# EAGLE schematic ESP-XBee_v0.1 (EAGLE 7.5.0)
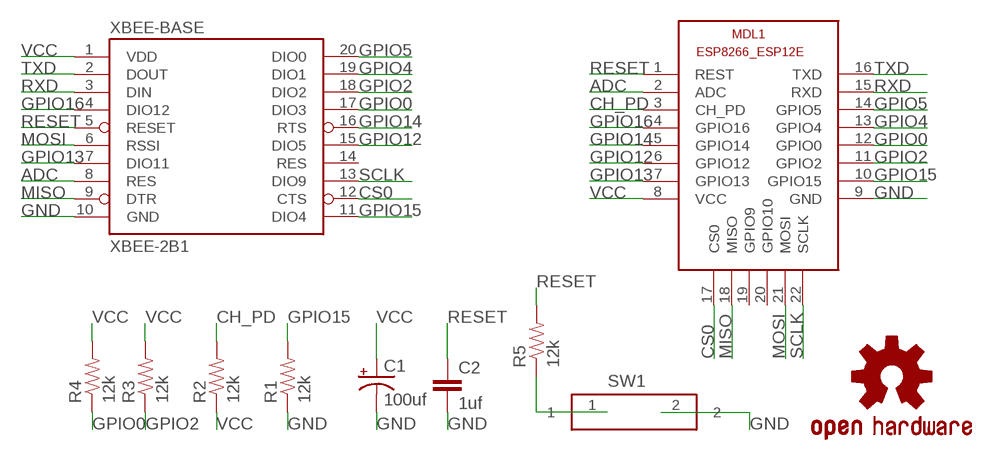
[diagram p0: schematic, sheet 1]

## Parts
C1  100uf  CAP_POL1206-KIT  [EIA3216-KIT]
C2  1uf  CAP0805  [0805]
LOGO3  OSHW-LOGOS  [OSHW-LOGO-S]
MDL1  ESP8266-12EESP8266-ESP12E  [ESP8266-ESP12E]
R1  12k  RESISTOR0805-RES  [0805]
R2  12k  RESISTOR0805-RES  [0805]
R3  12k  RESISTOR0805-RES  [0805]
R4  12k  RESISTOR0805-RES  [0805]
R5  12k  RESISTOR0805-RES  [0805]
SW1  434111043826  [434111043826]
XBEE-BASE  XBEE-2B1  [XBEE-1]

## Nets
ADC: MDL1.2(ADC) XBEE-BASE.8(RES)
CH_PD: MDL1.3(CH_PD) R2.2
CS0: MDL1.17(CS0) XBEE-BASE.12(CTS)
GND: C1.C(-) C2.2 MDL1.9(GND) R1.1 SW1.2 XBEE-BASE.10(GND)
GPIO0: MDL1.12(GPIO0) R4.1 XBEE-BASE.17(DIO3)
GPIO2: MDL1.11(GPIO2) R3.1 XBEE-BASE.18(DIO2)
GPIO4: MDL1.13(GPIO4) XBEE-BASE.19(DIO1)
GPIO5: MDL1.14(GPIO5) XBEE-BASE.20(DIO0)
GPIO12: MDL1.6(GPIO12) XBEE-BASE.15(DIO5)
GPIO13: MDL1.7(GPIO13) XBEE-BASE.7(DIO11)
GPIO14: MDL1.5(GPIO14) XBEE-BASE.16(RTS)
GPIO15: MDL1.10(GPIO15) R1.2 XBEE-BASE.11(DIO4)
GPIO16: MDL1.4(GPIO16) XBEE-BASE.4(DIO12)
MISO: MDL1.18(MISO) XBEE-BASE.9(DTR)
MOSI: MDL1.21(MOSI) XBEE-BASE.6(RSSI)
N$1: R5.1 SW1.1
RESET: C2.1 MDL1.1(REST) R5.2 XBEE-BASE.5(RESET)
RXD: MDL1.15(RXD) XBEE-BASE.3(DIN)
SCLK: MDL1.22(SCLK) XBEE-BASE.13(DIO9)
TXD: MDL1.16(TXD) XBEE-BASE.2(DOUT)
VCC: C1.A(+) MDL1.8(VCC) R2.1 R3.2 R4.2 XBEE-BASE.1(VDD)
Unconnected: MDL1.19(GPIO9) MDL1.20(GPIO10) XBEE-BASE.14(RES)

## Library data of the parts
C1 = SparkFun-Capacitors:CAP_POL: Capacitor Polarized These are standard SMD and PTH capacitors. Normally 10uF, 47uF, and 100uF in electrolytic and tantalum varieties. Always verify the external diameter of the through hole cap, it varies with capacity, voltage, and manufacturer. The EIA devices should be standard.
C2 = SparkFun-Capacitors:CAP: Capacitor Standard 0603 ceramic capacitor, and 0.1" leaded capacitor.
LOGO3 = SparkFun-Aesthetics:OSHW-LOGO: Open Source Hardware Logo This logo indicates the piece of hardware it is found on incorporates a OSHW license and/or adheres to the definition of open source hardware found here: http://freedomdefined.org/OSHW
MDL1 = ESP8266-ESP12E:ESP8266-12E: ESP8266-12E with additional I/O and GPIO04/05 corrected The author cannot warrant that this library is free from error or will meet your specific requirements. Created by PuceBaboon.com. Komagane, Nagano, JAPAN
R1-R5 = SparkFun-Passives:RESISTOR: Resistor Basic schematic elements and footprints for 0603, 1206, and PTH resistors.
SW1 = Switches_rev16a:434111043826: WS-TRS-6x3.5 mm SMD Tact Switch, 2 pins
XBEE-BASE = SparkFun-RF:XBEE-2: Xbee module footprints SMT header is CONN-09042.